# EAGLE design board (EAGLE 9.6.2)
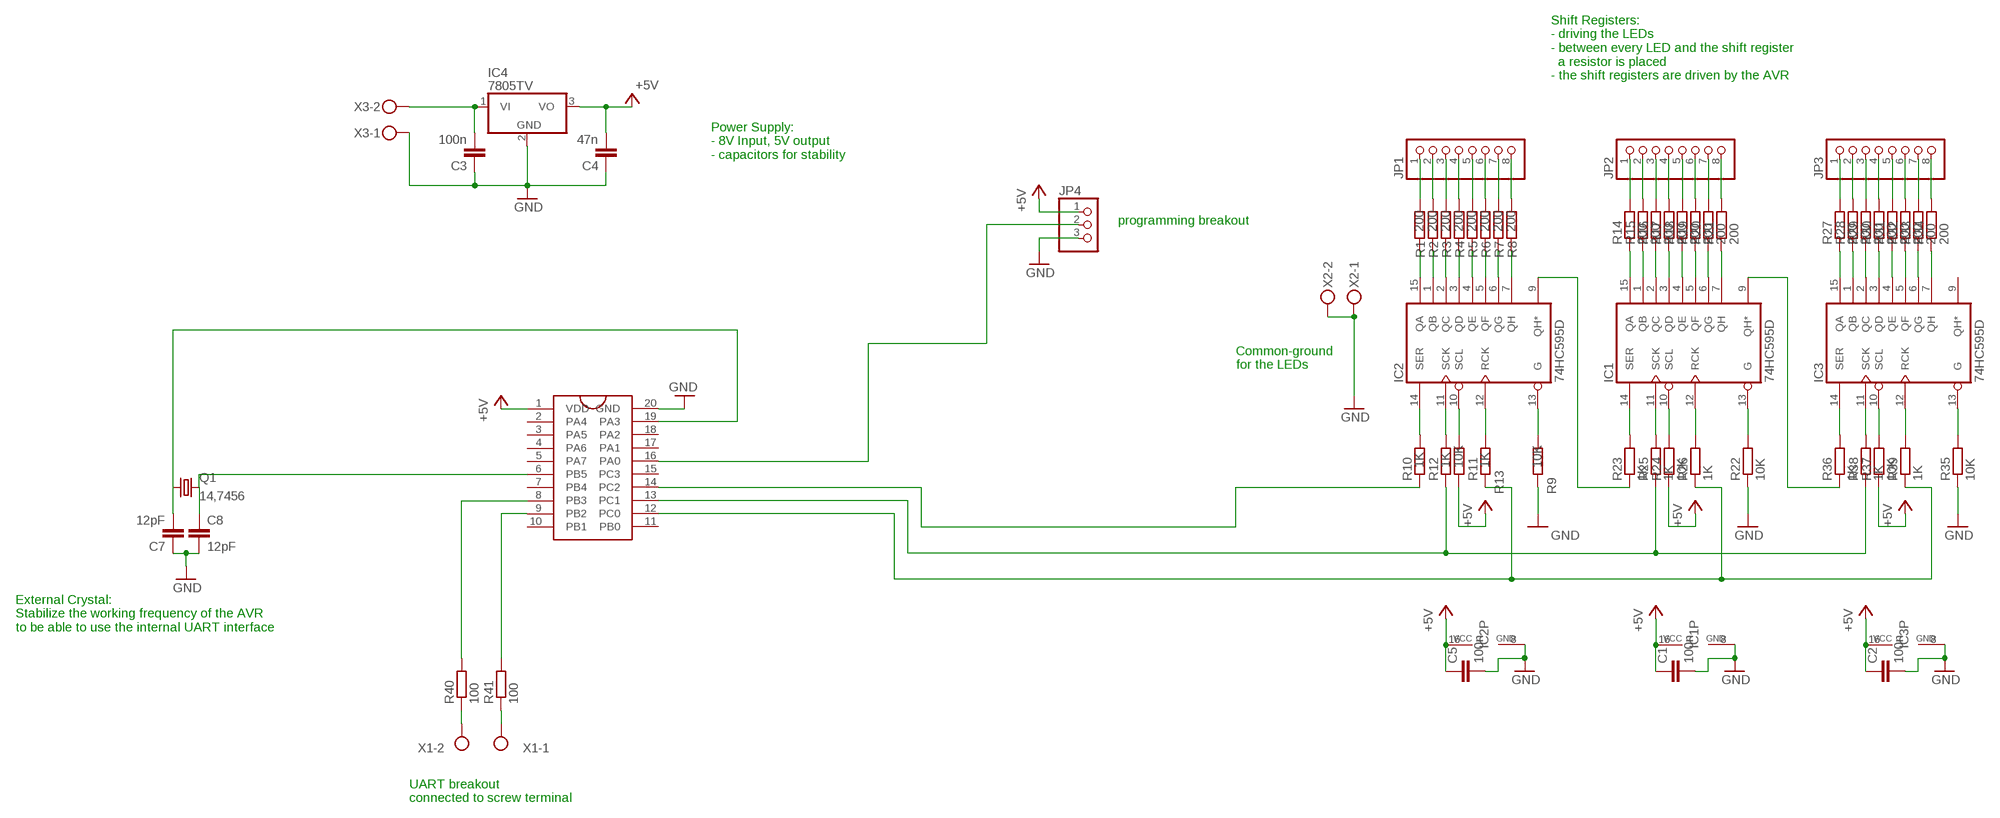
[diagram p0: schematic, sheet 1]

## Parts
C1  100n  C-EUC0805K  [C0805K]
C2  100n  C-EUC0805K  [C0805K]
C3  100n  C-EUC0805K  [C0805K]
C4  47n  C-EUC0805K  [C0805K]
C5  100n  C-EUC0805K  [C0805K]
C7  12pF  C-EUC0805K  [C0805K]
C8  12pF  C-EUC0805K  [C0805K]
IC1  74HC595D  [SO16]
IC2  74HC595D  [SO16]
IC3  74HC595D  [SO16]
IC4  7805TV  [TO220V]
JP1  PINHD-1X8  [1X08]
JP2  PINHD-1X8  [1X08]
JP3  PINHD-1X8  [1X08]
JP4  PINHD-1X3  [1X03]
Q1  14,7456  CRYSTALSM49  [SM49]
R1  200  R-EU_M0805  [M0805]
R2  200  R-EU_M0805  [M0805]
R3  200  R-EU_M0805  [M0805]
R4  200  R-EU_M0805  [M0805]
R5  200  R-EU_M0805  [M0805]
R6  200  R-EU_M0805  [M0805]
R7  200  R-EU_M0805  [M0805]
R8  200  R-EU_M0805  [M0805]
R9  10K  R-EU_M0805  [M0805]
R10  1K  R-EU_M0805  [M0805]
R11  10K  R-EU_M0805  [M0805]
R12  1K  R-EU_M0805  [M0805]
R13  1K  R-EU_M0805  [M0805]
R14  200  R-EU_M0805  [M0805]
R15  200  R-EU_M0805  [M0805]
R16  200  R-EU_M0805  [M0805]
R17  200  R-EU_M0805  [M0805]
R18  200  R-EU_M0805  [M0805]
R19  200  R-EU_M0805  [M0805]
R20  200  R-EU_M0805  [M0805]
R21  200  R-EU_M0805  [M0805]
R22  10K  R-EU_M0805  [M0805]
R23  1K  R-EU_M0805  [M0805]
R24  10K  R-EU_M0805  [M0805]
R25  1K  R-EU_M0805  [M0805]
R26  1K  R-EU_M0805  [M0805]
R27  200  R-EU_M0805  [M0805]
R28  200  R-EU_M0805  [M0805]
R29  200  R-EU_M0805  [M0805]
R30  200  R-EU_M0805  [M0805]
R31  200  R-EU_M0805  [M0805]
R32  200  R-EU_M0805  [M0805]
R33  200  R-EU_M0805  [M0805]
R34  200  R-EU_M0805  [M0805]
R35  10K  R-EU_M0805  [M0805]
R36  1K  R-EU_M0805  [M0805]
R37  10K  R-EU_M0805  [M0805]
R38  1K  R-EU_M0805  [M0805]
R39  1K  R-EU_M0805  [M0805]
R40  100  R-EU_M0805  [M0805]
R41  100  R-EU_M0805  [M0805]
U$1  ATTINY406  [SO20L]
X1  MKDSN1,5/2-5,08  [MKDSN1,5/2-5,08]
X2  MKDSN1,5/2-5,08  [MKDSN1,5/2-5,08]
X3  MKDSN1,5/2-5,08  [MKDSN1,5/2-5,08]

## Nets
+5V: C1.1 C2.1 C4.2 C5.1 IC1.16(VCC) IC2.16(VCC) IC3.16(VCC) IC4.3(VO) JP4.1 R11.1 R24.1 R37.1 U$1.1(VDD)
GND: C1.2 C2.2 C3.1 C4.1 C5.2 C7.1 C8.2 IC1.8(GND) IC2.8(GND) IC3.8(GND) IC4.2(GND) JP4.3 R9.1 R22.1 R35.1 U$1.20(GND) X2.1 X2.2 X3.1
N$1: IC2.15(QA) R1.1
N$2: IC2.1(QB) R2.1
N$3: IC2.2(QC) R3.1
N$4: IC2.3(QD) R4.1
N$5: IC2.4(QE) R5.1
N$6: IC2.5(QF) R6.1
N$7: IC2.6(QG) R7.1
N$8: IC2.7(QH) R8.1
N$9: IC2.13(G) R9.2
N$10: IC2.14(SER) R10.2
N$11: IC2.11(SCK) R12.2
N$12: IC2.10(SCL) R11.2
N$13: IC2.12(RCK) R13.2
N$14: JP1.1 R1.2
N$15: JP1.2 R2.2
N$16: JP1.3 R3.2
N$17: JP1.4 R4.2
N$18: JP1.5 R5.2
N$19: JP1.6 R6.2
N$20: JP1.7 R7.2
N$21: JP1.8 R8.2
N$22: IC1.15(QA) R14.1
N$23: IC1.1(QB) R15.1
N$24: IC1.2(QC) R16.1
N$25: IC1.3(QD) R17.1
N$26: IC1.4(QE) R18.1
N$27: IC1.5(QF) R19.1
N$28: IC1.6(QG) R20.1
N$29: IC1.7(QH) R21.1
N$30: IC1.13(G) R22.2
N$31: IC1.14(SER) R23.2
N$32: IC1.11(SCK) R25.2
N$33: IC1.10(SCL) R24.2
N$34: IC1.12(RCK) R26.2
N$35: JP2.1 R14.2
N$36: JP2.2 R15.2
N$37: JP2.3 R16.2
N$38: JP2.4 R17.2
N$39: JP2.5 R18.2
N$40: JP2.6 R19.2
N$41: JP2.7 R20.2
N$42: JP2.8 R21.2
N$43: IC3.15(QA) R27.1
N$44: IC3.1(QB) R28.1
N$45: IC3.2(QC) R29.1
N$46: IC3.3(QD) R30.1
N$47: IC3.4(QE) R31.1
N$48: IC3.5(QF) R32.1
N$49: IC3.6(QG) R33.1
N$50: IC3.7(QH) R34.1
N$51: IC3.13(G) R35.2
N$52: IC3.14(SER) R36.2
N$53: IC3.11(SCK) R38.2
N$54: IC3.10(SCL) R37.2
N$55: IC3.12(RCK) R39.2
N$56: JP3.1 R27.2
N$57: JP3.2 R28.2
N$58: JP3.3 R29.2
N$59: JP3.4 R30.2
N$60: JP3.5 R31.2
N$61: JP3.6 R32.2
N$62: JP3.7 R33.2
N$63: JP3.8 R34.2
N$64: IC2.9(QH*) R23.1
N$65: IC1.9(QH*) R36.1
N$66: R40.1 X1.2
N$67: R12.1 R25.1 R38.1 U$1.13(PC1)
N$68: R13.1 R26.1 R39.1 U$1.12(PC0)
N$69: R40.2 U$1.8(PB3)
N$70: R41.2 U$1.9(PB2)
N$71: R41.1 X1.1
N$72: C3.2 IC4.1(VI) X3.2
N$73: R10.1 U$1.14(PC2)
N$74: C7.2 Q1.1 U$1.19(PA3)
N$75: JP4.2 U$1.16(PA0)
N$78: C8.1 Q1.2 U$1.6(PB5)
Unconnected: IC3.9(QH*) U$1.2(PA4) U$1.3(PA5) U$1.4(PA6) U$1.5(PA7) U$1.7(PB4) U$1.10(PB1) U$1.11(PB0) U$1.15(PC3) U$1.17(PA1) U$1.18(PA2)

## Notes on the sheet
- Shift Registers:
  - driving the LEDs
  - between every LED and the shift register
    a resistor is placed
  - the shift registers are driven by the AVR
- Power Supply:
  - 8V Input, 5V output
  - capacitors for stability
- programming breakout
- Common-ground
  for the LEDs
- External Crystal:
  Stabilize the working frequency of the AVR
  to be able to use the internal UART interface
- UART breakout
  connected to screw terminal

## Library data of the parts
C1-C5 C7 C8 = rcl:C-EU: CAPACITOR, European symbol; SPICEPREFIX: C
IC1-IC3 = 74xx-eu:74*595: 8-bit SHIFT REGISTER, output latch
IC4 = linear:78*: Positive VOLTAGE REGULATOR Source: http://cache.national.com/ds/LM/LM78L05.pdf http://www.fairchildsemi.com/ds/LM/LM7805.pdf
JP1-JP3 = Connector:PINHD-1X8: PIN HEADER; CATEGORY: CONNECTOR; SUB-CATEGORY: PIN-HEADER
JP4 = pinhead:PINHD-1X3: PIN HEADER
Q1 = crystal:CRYSTAL: CRYSTAL; OC_FARNELL: unknown; OC_NEWARK: unknown
R1-R41 = resistor:R-EU_: RESISTOR, European symbol
U$1 = My_AVRs:ATTINY406
X1-X3 = con-phoenix-508:MKDSN1,5/2-5,08: MKDSN 1,5/ 2-5,08 Printklemme Nennstrom: 13,5 A Nennspannung: 250 V Rastermaß: 5,08 mm Polzahl: 2 Anschlussart: Schraubanschluss Montage: Löten Anschlussrichtung Leiter/Platine: 0 ° Artikelnummer: 1729128 Source: http://eshop.phoenixcontact.com .. 1729128.pdf

## Board
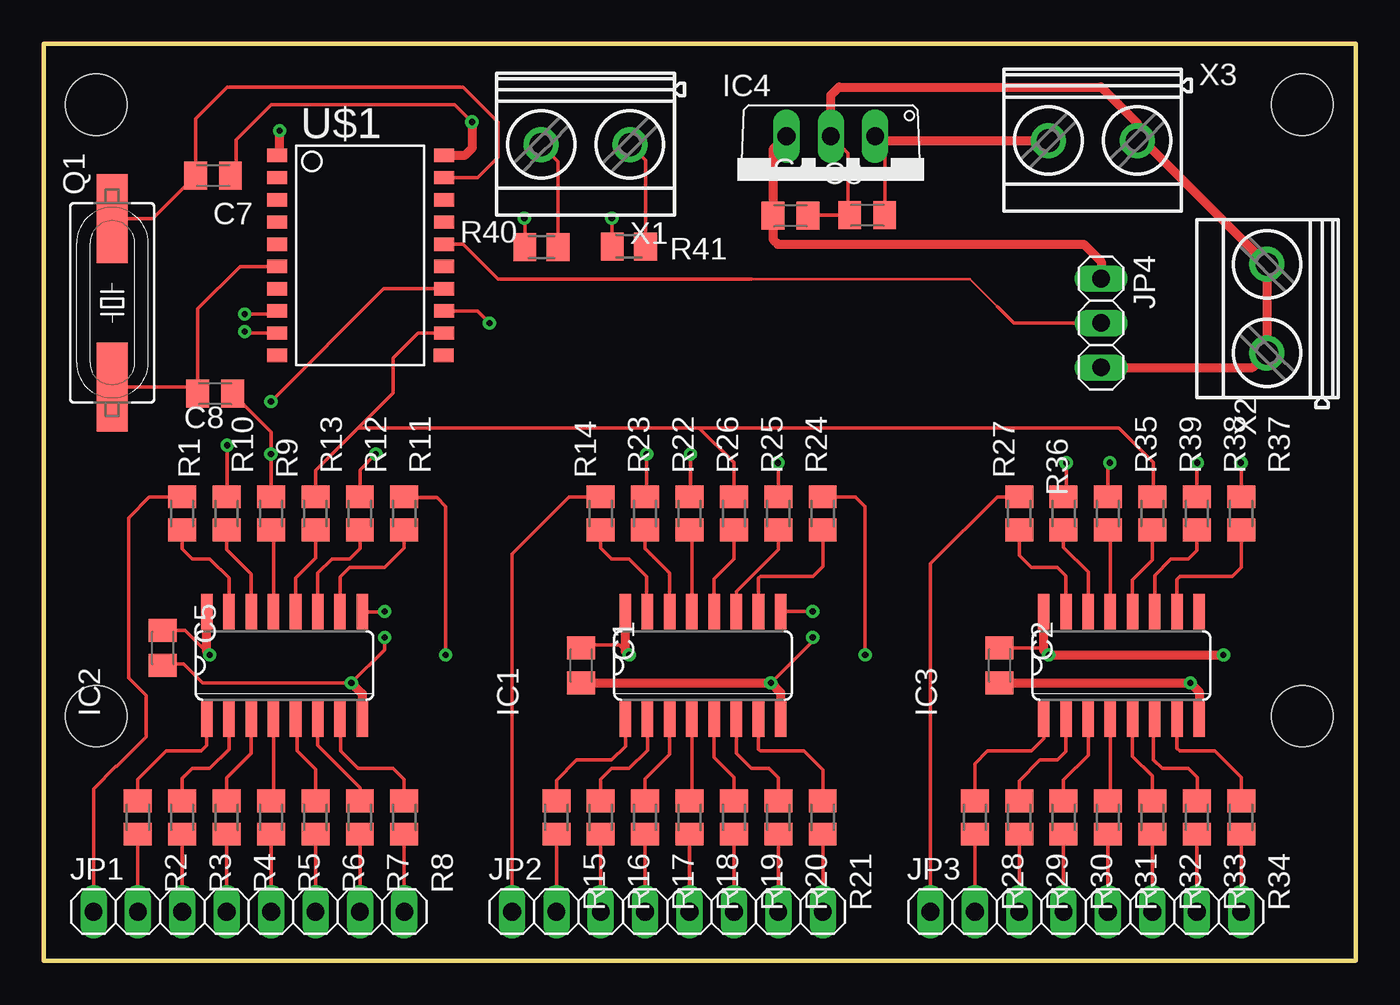
[diagram p1: board, top side]
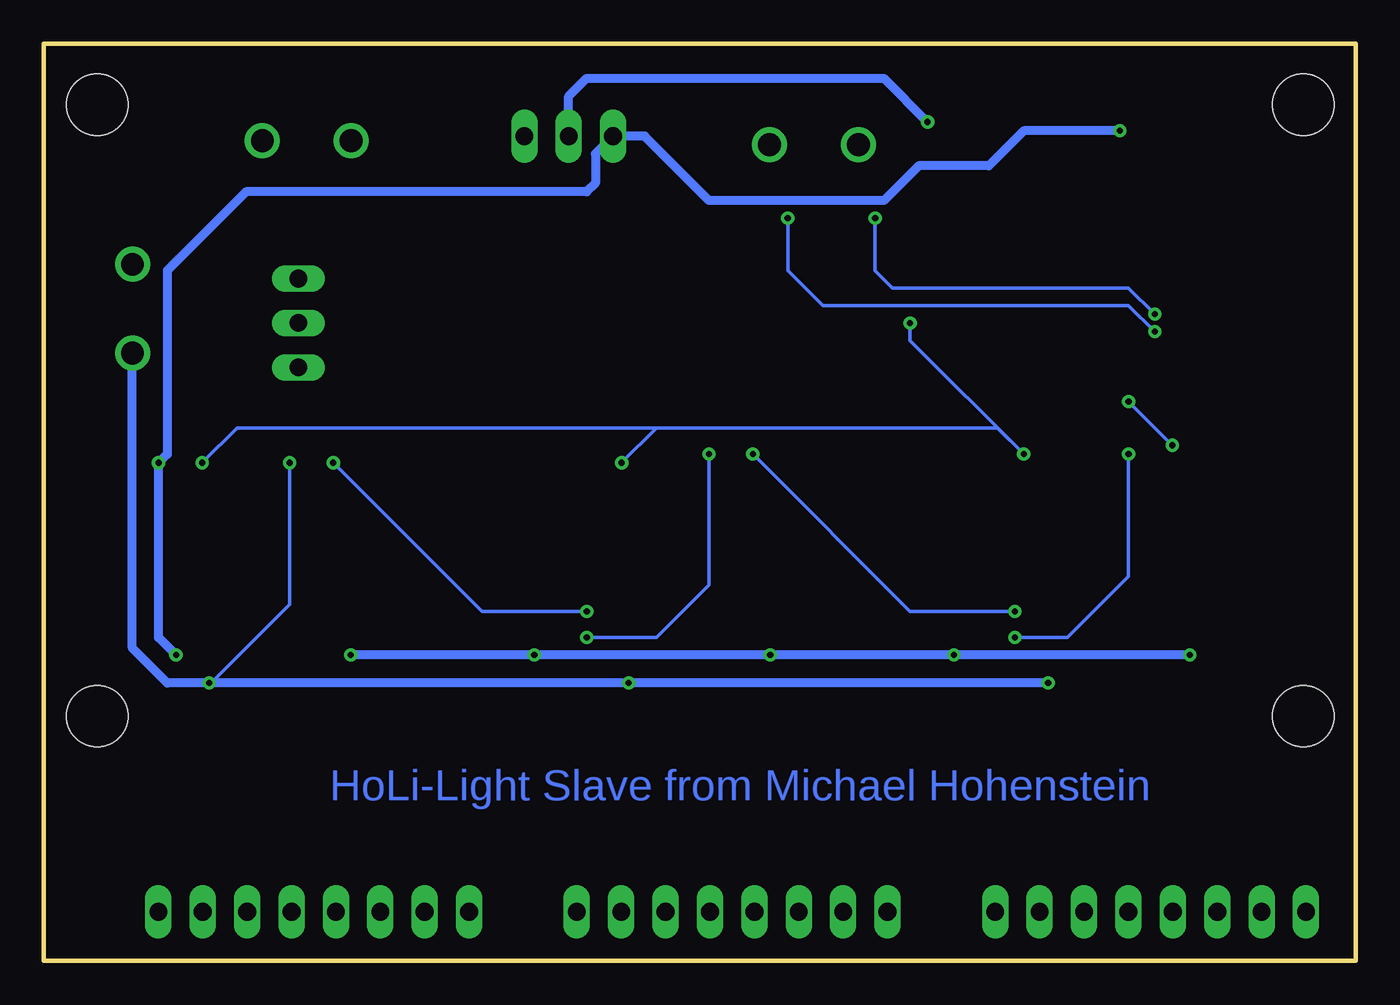
[diagram p2: board, bottom side, seen from below]

Size 75.07 x 52.48 mm. Coordinates in mm from the lower left corner, seen from the top.
Outline: 0,0 75.07,0 75.07,52.48 0,52.48 0,0
Copper layers (1*16): Top 0.035mm / dielectric 1.5mm / Bottom 0.035mm
Design rules "default": minimum track width 6mil, minimum drill 0.35mm, track to track 6mil, track to pad 6mil, pad to pad 6mil, via to via 6mil, smd to smd 6mil, copper to edge 40mil, drill to drill 6mil, minimum pad ring 10mil, minimum via ring 8mil, stop-mask expansion 4mil, vias tented up to drill 0mil, thermal gap 10mil
Holes 3.5 mm at 3,14 3,49 72,14 72,49

### Footprints (pad centres in the part's own frame; a part is rotated, then mirrored left to right if it is on the bottom)
C0805K = smd 1.3 x 1.6: 1 -1,0; 2 1,0
SO16 = smd 0.66 x 2.032: 1 -4.445,-3.073; 2 -3.175,-3.073; 3 -1.905,-3.073; 4 -0.635,-3.073; 5 0.635,-3.073; 6 1.905,-3.073; 7 3.175,-3.073; 8 4.445,-3.073; 9 4.445,3.073; 10 3.175,3.073; 11 1.905,3.073; 12 0.635,3.073; 13 -0.635,3.073; 14 -1.905,3.073; 15 -3.175,3.073; 16 -4.445,3.073
TO220V = drill 1.016 long: 1 -2.54,-2.54; 2 0,-2.54; 3 2.54,-2.54
1X08 = drill 1.016 long: 1 -8.89,0; 2 -6.35,0; 3 -3.81,0; 4 -1.27,0; 5 1.27,0; 6 3.81,0; 7 6.35,0; 8 8.89,0
1X03 = drill 1.016 long: 1 -2.54,0; 2 0,0; 3 2.54,0
SM49 = smd 5.08 x 1.778: 1 -4.826,0; 2 4.826,0
M0805 = smd 1.3 x 1.6: 1 -0.95,0; 2 0.95,0
SO20L = smd 0.762 x 1.143: 1 -5.08,-5.131; 2 -3.81,-5.131; 3 -2.54,-5.131; 4 -1.27,-5.131; 5 0,-5.131; 6 1.27,-5.131; 7 2.54,-5.131; 8 3.81,-5.131; 9 5.08,-5.131; 10 6.35,-5.131; 11 6.35,4.369; 12 5.08,4.394; 13 3.81,4.394; 14 2.54,4.394; 15 1.27,4.394; 16 0,4.394; 17 -1.27,4.394; 18 -2.54,4.394; 19 -3.81,4.394; 20 -5.08,4.394
MKDSN1,5/2-5,08 = drill 1.3 pad 2: 1 -2.561,0.025; 2 2.519,0.025

### Placement (x,y rotation side)
C1  30.75,16.9 270 top
C2  54.69,16.9 270 top
C3  47.12,42.66 0 top
C4  42.73,42.63 180 top
C5  6.81,17.9 270 top
C7  9.69,44.93 180 top
C8  9.81,32.45 0 top
IC1  37.72,16.9 0 top
IC2  13.78,16.9 0 top
IC3  61.66,16.9 0 top
IC4  45.03,44.65 180 top
JP1  11.74,2.81 0 top
JP2  35.68,2.81 0 top
JP3  59.62,2.81 0 top
JP4  60.5,36.5 270 top
Q1  3.92,37.65 270 top
R1  7.93,25.6 90 top
R2  5.39,8.2 270 top
R3  7.93,8.2 270 top
R4  10.47,8.2 270 top
R5  13.01,8.2 270 top
R6  15.55,8.2 270 top
R7  18.09,8.2 270 top
R8  20.63,8.2 270 top
R9  13.01,25.6 270 top
R10  10.47,25.6 270 top
R11  20.63,25.6 270 top
R12  18.09,25.6 270 top
R13  15.55,25.6 270 top
R14  31.87,25.6 90 top
R15  29.33,8.2 270 top
R16  31.87,8.2 270 top
R17  34.41,8.2 270 top
R18  36.95,8.2 270 top
R19  39.49,8.2 270 top
R20  42.03,8.2 270 top
R21  44.57,8.2 270 top
R22  36.95,25.6 270 top
R23  34.41,25.6 270 top
R24  44.57,25.6 270 top
R25  42.03,25.6 270 top
R26  39.49,25.6 270 top
R27  55.81,25.6 90 top
R28  53.27,8.2 270 top
R29  55.81,8.2 270 top
R30  58.35,8.2 270 top
R31  60.89,8.2 270 top
R32  63.43,8.2 270 top
R33  65.97,8.2 270 top
R34  68.51,8.2 270 top
R35  60.89,25.6 270 top
R36  58.35,25.6 270 top
R37  68.51,25.6 270 top
R38  65.97,25.6 270 top
R39  63.43,25.6 270 top
R40  28.48,40.84 180 top
R41  33.48,40.88 180 top
U$1  18.5,41 270 top
X1  30.98,46.73 180 top
X2  70.01,37.34 90 top
X3  60,46.96 180 top

### Tracks (layer width: path | path; a pad name or v marks a point on that pad's centre or on a via)
+5V  (via drill 0.35)
  Top 0.2: C1.1 30.93,18.07 32.92,18.07 v33.5,17.5 | C2.1 57.1,17.9 v57.5,17.5 | R11.1 20.68,26.5 22.5,26.5 23,26 v23,17.5 | R24.1 46.45,26.55 47,26 v47,17.5 | v9.5,17.5 8.1,18.9 C5.1 | R37.1 v68.51,28.49 v68.5,28.5
  Top 0.508: v9.5,17.5 9.34,17.66 IC2.16 | v33.5,17.5 33.27,17.73 IC1.16 | IC3.16 57.22,17.79 v57.5,17.5 v67.5,17.5 | U$1.1 13.5,46.21 v13.5,47.5 | IC4.3 41.73,46.43 C4.2 41.73,41.27 42,41 59.5,41 60.5,40 JP4.1
  Bottom 0.508: v57.5,17.5 v47,17.5 v33.5,17.5 v23,17.5 v9.5,17.5 | v13.5,47.5 19,47.5 21,45.5 25,45.5 27,43.5 37,43.5 40.69,47.19 IC4.3 43.5,46.18 43.5,44.5 44,44 63.5,44 68,39.5 68,29 v68.5,28.5 68.5,18.5 v67.5,17.5
GND  (via drill 0.35)
  Top 0.2: v41.6,15.9 44,18.3 v44,18.5 | v37,29 37,26.6 R22.1 | v19.5,18.5 19.5,17.8 v17.6,15.9 9.1,15.9 8,17 6.91,17 C5.2 | R9.1 v13.01,28.99 v13,29 13,30.26 C8.2 | R35.1 60.89,28.39 v61,28.5 | C4.1 43.76,42.66 46,42.66 | 46,42.66 C3.1 | IC4.2 46,46.22 46,42.66 | C7.1 11,45.24 11,47 13,49 23.5,49 v24.5,48
  Top 0.508: C1.2 v41.6,15.9 42.16,15.34 IC1.8 | v17.6,15.9 18.23,15.28 IC2.8 | IC3.8 66.11,15.39 v65.6,15.9 C2.2 | IC4.2 45.03,49.53 45.5,50 60.5,50 62.56,47.94 X3.1 62.91,46.94 X2.2 X2.1 69.17,33.96 JP4.3 | v24.5,48 24.5,46.5 24.08,46.08 U$1.20
  Bottom 0.2: v65.6,15.9 65.5,15.9 61,20.4 v61,28.5 | v44,18.5 40,18.5 37,21.5 v37,29 | v19.5,18.5 16.5,18.5 13,22 v13,29
  Bottom 0.508: v17.6,15.9 v41.6,15.9 65.5,15.9 | v65.6,15.9 68,15.9 70,17.9 70,34.76 X2.1 | IC4.2 45.03,49.47 44,50.5 27,50.5 v24.5,48
N$1
  Top 0.2: IC2.15 10.61,21.89 9.5,23 8.5,23 7.93,23.57 R1.1
N$2
  Top 0.2: IC2.1 9.34,12.34 9,12 7,12 5.39,10.39 R2.1
N$3
  Top 0.2: IC2.2 10.61,12.11 9.5,11 8.5,11 7.93,10.43 R3.1
N$4
  Top 0.2: IC2.3 11.88,11.88 10.47,10.47 R4.1
N$5
  Top 0.2: IC2.4 13.14,9.29 R5.1
N$6
  Top 0.2: IC2.5 14.5,13.74 14.5,12 15.55,10.95 R6.1
N$7
  Top 0.2: R7.1 18.09,9.91 15.69,12.31 IC2.6
N$8
  Top 0.2: IC2.7 17,13.78 17,12 18,11 20,11 20.63,10.37 R8.1
N$9
  Top 0.2: IC2.13 13.14,24.52 R9.2
N$10
  Top 0.2: IC2.14 11.88,22.12 10.47,23.53 R10.2
N$11
  Top 0.2: IC2.11 15.69,22.18 16.5,23 17.5,23 18.09,23.59 R12.2
N$12
  Top 0.2: IC2.10 16.95,21.95 17.5,22.5 19.5,22.5 20.63,23.63 R11.2
N$13
  Top 0.2: IC2.12 14.41,21.91 15.55,23.05 R13.2
N$14
  Top 0.2: R1.2 6.05,26.55 4.85,25.35 4.85,16.2 5.87,15.19 5.87,12.81 4.19,11.13 4.13,11.13 2.85,9.85 JP1.1
N$15
  Top 0.2: JP1.2 R2.2
N$16
  Top 0.2: R3.2 JP1.3
N$17
  Top 0.2: JP1.4 R4.2
N$18
  Top 0.2: JP1.5 R5.2
N$19
  Top 0.2: JP1.6 R6.2
N$20
  Top 0.2: JP1.7 R7.2
N$21
  Top 0.2: JP1.8 R8.2
N$22
  Top 0.2: IC1.15 34.5,20.02 34.5,22 33.5,23 32.5,23 31.87,23.63 R14.1
N$23
  Top 0.2: IC1.1 33.27,12.28 32.5,11.5 30.5,11.5 29.33,10.33 R15.1
N$24
  Top 0.2: IC1.2 34.55,12.04 33.5,11 32.5,11 31.87,10.37 R16.1
N$25
  Top 0.2: R17.1 34.41,10.41 35.81,11.81 IC1.3
N$26
  Top 0.2: IC1.4 37.09,9.29 R18.1
N$27
  Top 0.2: IC1.5 38.35,11.64 39.49,10.51 R19.1
N$28
  Top 0.2: IC1.6 39.62,11.88 40.5,11 41.5,11 42.03,10.47 R20.1
N$29
  Top 0.2: IC1.7 40.9,12.11 41,12 43.5,12 44.57,10.93 R21.1
N$30
  Top 0.2: IC1.13 37.09,24.52 R22.2
N$31
  Top 0.2: IC1.14 35.81,22.18 34.41,23.59 R23.2
N$32
  Top 0.2: IC1.11 39.62,21.12 42.03,23.53 R25.2
N$33
  Top 0.2: IC1.10 40.9,21.89 41,22 44,22 44.57,22.57 R24.2
N$34
  Top 0.2: IC1.12 38.35,21.86 39.5,23 R26.2
N$35
  Top 0.2: R14.2 30.05,26.55 26.79,23.29 JP2.1
N$36
  Top 0.2: JP2.2 R15.2
N$37
  Top 0.2: JP2.3 R16.2
N$38
  Top 0.2: JP2.4 R17.2
N$39
  Top 0.2: JP2.5 R18.2
N$40
  Top 0.2: JP2.6 R19.2
N$41
  Top 0.2: JP2.7 R20.2
N$42
  Top 0.2: JP2.8 R21.2
N$43
  Top 0.2: IC3.15 58.48,22.02 58,22.5 56.5,22.5 55.81,23.19 R27.1
N$44
  Top 0.2: IC3.1 57.22,12.71 56.5,12 54,12 53.27,11.27 R28.1
N$45
  Top 0.2: IC3.2 58.48,11.98 58,11.5 57,11.5 55.81,10.31 R29.1
N$46
  Top 0.2: IC3.3 59.76,11.76 58.35,10.35 R30.1
N$47
  Top 0.2: IC3.4 61.02,9.29 R31.1
N$48
  Top 0.2: IC3.5 62.3,11.71 63.43,10.57 R32.1
N$49
  Top 0.2: IC3.6 63.5,13.76 63.5,11.5 64,11 65.5,11 66,10.5 66,9.18 R33.1
N$50
  Top 0.2: IC3.7 64.83,12.16 65,12 67,12 68.51,10.49 R34.1
N$51
  Top 0.2: IC3.13 61.02,24.52 R35.2
N$52
  Top 0.2: IC3.14 59.76,22.25 58.35,23.65 R36.2
N$53
  Top 0.2: IC3.11 63.56,22.07 64.5,23 65.5,23 65.97,23.47 R38.2
N$54
  Top 0.2: IC3.10 64.83,21.84 65,22 68,22 68.51,22.51 R37.2
N$55
  Top 0.2: IC3.12 62.3,21.8 63.43,22.93 R39.2
N$56
  Top 0.2: R27.2 54.55,26.55 50.73,22.73 JP3.1
N$57
  Top 0.2: JP3.2 R28.2
N$58
  Top 0.2: JP3.3 R29.2
N$59
  Top 0.2: JP3.4 R30.2
N$60
  Top 0.2: JP3.5 R31.2
N$61
  Top 0.2: JP3.6 R32.2
N$62
  Top 0.2: JP3.7 R33.2
N$63
  Top 0.2: JP3.8 R34.2
N$64  (via drill 0.35)
  Top 0.2: IC2.9 19.47,19.97 v19.5,20 | v34.5,29 34.5,26.64 R23.1
  Bottom 0.2: v19.5,20 25.5,20 v34.5,29
N$65  (via drill 0.35)
  Top 0.2: IC1.9 42.19,20 v44,20 | v58.5,28.5 58.5,26.7 R36.1
  Bottom 0.2: v44,20 50,20 v58.5,28.5
N$66
  Top 0.2: X1.2 29.43,45.74 R40.1
N$67  (via drill 0.35)
  Top 0.2: R12.1 18.09,28.09 v19,29 | v42,28.5 42.03,28.47 R25.1 | R38.1 65.97,28.47 v66,28.5 | v25.5,36.5 24.81,37.19 U$1.13
  Bottom 0.2: 40,30.5 v42,28.5 | 40,30.5 20.5,30.5 v19,29 25.5,35.5 v25.5,36.5 | v66,28.5 64,30.5 40,30.5
N$68
  Top 0.2: R13.1 15.55,28.05 18,30.5 | 37.5,30.5 39.5,28.5 R26.1 | 18,30.5 37.5,30.5 | 37.5,30.5 61.5,30.5 63.5,28.5 63.5,26.62 R39.1 | 18,30.5 20,32.5 20,34.5 21.42,35.92 U$1.12
N$69  (via drill 0.35)
  Top 0.2: U$1.8 13.18,37 v11.5,37 | v27.5,42.5 27.53,42.47 R40.2
  Bottom 0.2: v11.5,37 13,38.5 26.5,38.5 27.5,39.5 v27.5,42.5
N$70  (via drill 0.35)
  Top 0.2: U$1.9 11.58,35.92 v11.5,36 | v32.5,42.5 32.53,42.47 R41.2
  Bottom 0.2: v11.5,36 13,37.5 30.5,37.5 32.5,39.5 v32.5,42.5
N$71
  Top 0.2: X1.1 34.43,45.82 R41.1
N$72
  Top 0.2: IC4.1 48.12,46.64 C3.2
  Top 0.508: IC4.1 47.83,46.94 X3.2
N$73  (via drill 0.35)
  Top 0.2: R10.1 10.5,26.58 v10.5,29.5 | v13,32 19.46,38.46 U$1.14
  Bottom 0.2: v10.5,29.5 v13,32
N$74
  Top 0.2: Q1.1 6.24,42.48 C7.2 8.69,48.19 10.5,50 24,50 26,48 26,46 24.81,44.81 U$1.19
N$75
  Top 0.152: 40.5,39 53,39 54.55,37.45
  Top 0.2: 54.55,37.45 55.5,36.5 JP4.2 | U$1.16 24,41 26,39 40.5,39
N$78
  Top 0.2: Q1.2 8.44,32.82 C8.1 8.81,37.31 11.23,39.73 U$1.6

### Text on the board
Bottom: HoLi-Light Slave from Michael Hohenstein
tValues: Rx | VCC | GND | Tx | GND